# Altium project DL4-1BA.PrjPcb (part 2 of 2)

## Sheet PoE_Injector.SchDoc: IEEE 802.3AF/AT PSE Controller
size A3; CompanyName: FSCH; DrawnBy: ahorat / daniw; Engineer: ahorat / daniw; Address1: FS Switzerland; Address2: Zeltweg 57; Address3: 8032 Zürich; SheetNumber: 5; SheetTotal: 9
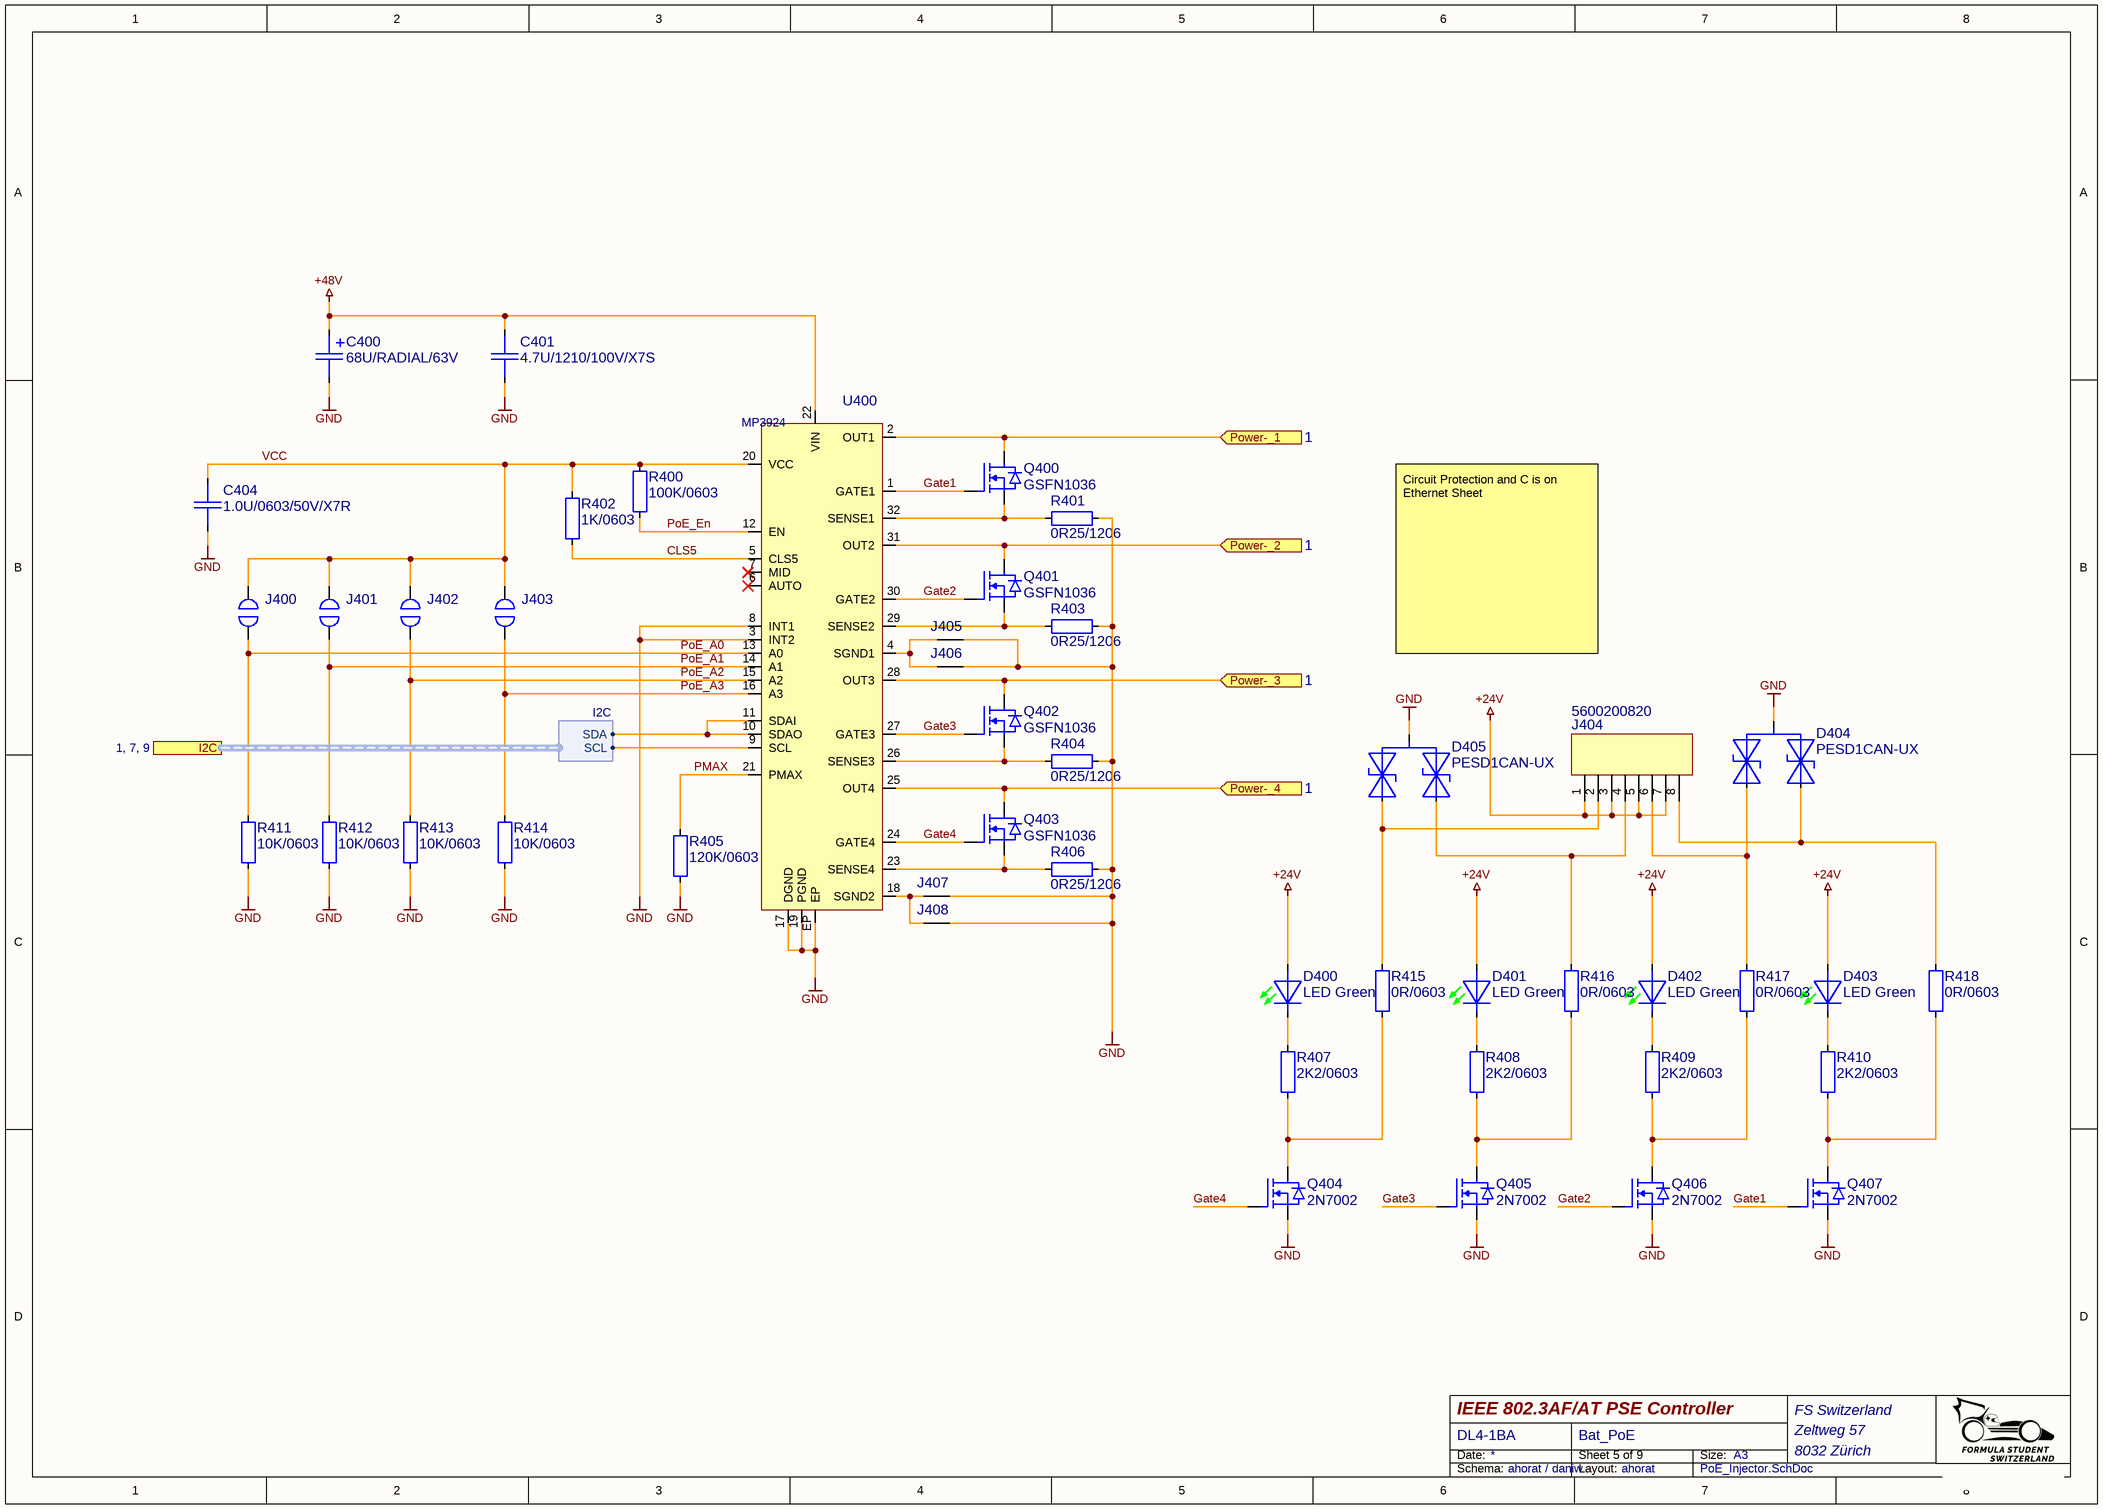
[diagram p3: PoE_Injector.SchDoc]

### Parts
C400  68U/RADIAL/63V  [CAP350P80X130]
C401  4.7U/1210/100V/X7S  [CAP1210_X7R]
C404  1.0U/0603/50V/X7R  [CAP0603_X7R]
D400  LED Green  [LED0603_GREEN]
D401  LED Green  [LED0603_GREEN]
D402  LED Green  [LED0603_GREEN]
D403  LED Green  [LED0603_GREEN]
D404  PESD1CAN-UX  [SOT65P210X95-3-SE]
D405  PESD1CAN-UX  [SOT65P210X95-3-SE]
J400  Solder Jumper 2pin 0.2mm small  [Solder_Jumper_2pin_0.2mm_small]  (value not drawn)
J401  Solder Jumper 2pin 0.2mm small  [Solder_Jumper_2pin_0.2mm_small]  (value not drawn)
J402  Solder Jumper 2pin 0.2mm small  [Solder_Jumper_2pin_0.2mm_small]  (value not drawn)
J403  Solder Jumper 2pin 0.2mm small  [Solder_Jumper_2pin_0.2mm_small]  (value not drawn)
J404  5600200820  [5600200820]
J405  NETTIE_025x050  [NETTIE_025x050]  (value not drawn)  (no BOM)
J406  NETTIE_025x050  [NETTIE_025x050]  (value not drawn)  (no BOM)
J407  NETTIE_025x050  [NETTIE_025x050]  (value not drawn)  (no BOM)
J408  NETTIE_025x050  [NETTIE_025x050]  (value not drawn)  (no BOM)
Q400  GSFN1036  [SON065P330X330X075-5-TH245X175]
Q401  GSFN1036  [SON065P330X330X075-5-TH245X175]
Q402  GSFN1036  [SON065P330X330X075-5-TH245X175]
Q403  GSFN1036  [SON065P330X330X075-5-TH245X175]
Q404  2N7002  [SOT2395P280X125-3-SE]
Q405  2N7002  [SOT2395P280X125-3-SE]
Q406  2N7002  [SOT2395P280X125-3-SE]
Q407  2N7002  [SOT2395P280X125-3-SE]
R400  100K/0603  [R0603-0.40-WW]
R401  0R25/1206  [R1206-0.80-WW]
R402  1K/0603  [R0603-0.40-WW]
R403  0R25/1206  [R1206-0.80-WW]
R404  0R25/1206  [R1206-0.80-WW]
R405  120K/0603  [R0603-0.40-WW]
R406  0R25/1206  [R1206-0.80-WW]
R407  2K2/0603  [R0603-0.40-WW]
R408  2K2/0603  [R0603-0.40-WW]
R409  2K2/0603  [R0603-0.40-WW]
R410  2K2/0603  [R0603-0.40-WW]
R411  10K/0603  [R0603-0.40-WW]
R412  10K/0603  [R0603-0.40-WW]
R413  10K/0603  [R0603-0.40-WW]
R414  10K/0603  [R0603-0.40-WW]
R415  0R/0603  [R0603-0.40-WW]
R416  0R/0603  [R0603-0.40-WW]
R417  0R/0603  [R0603-0.40-WW]
R418  0R/0603  [R0603-0.40-WW]
U400  MP3924  [QFN050P500X500X100-32-TH360X360]

### Ports
I2C (harness I2C, see 1, 7, 9), Power-_1 (in, see 1), Power-_2 (in, see 1), Power-_3 (in, see 1), Power-_4 (in, see 1)

### Harnesses
I2C: SCL, SDA

### Nets
+24V: D400.2 D401.2 D402.2 D403.2 J404.1 J404.3 J404.5 J404.7
+48V: C400.1 C401.1 U400.22(VIN)
GND: C400.2 C401.2 C404.2 D404.3 D405.3 J405.2 J406.2 J407.2 J408.2 Q404.2(SOURCE) Q405.2(SOURCE) Q406.2(SOURCE) Q407.2(SOURCE) R401.2 R403.2 R404.2 R405.2 R406.2 R411.2 R412.2 R413.2 R414.2 U400.3(INT2) U400.8(INT1) U400.17(DGND) U400.19(PGND) U400.EP
CLS5: R402.2 U400.5(CLS5)
Gate1: Q400.G(GATE) Q407.1(GATE) U400.1(GATE1)
Gate2: Q401.G(GATE) Q406.1(GATE) U400.30(GATE2)
Gate3: Q402.G(GATE) Q405.1(GATE) U400.27(GATE3)
Gate4: Q403.G(GATE) Q404.1(GATE) U400.24(GATE4)
PMAX: R405.1 U400.21(PMAX)
PoE_A0: J400.2 R411.1 U400.13(A0)
PoE_A1: J401.2 R412.1 U400.14(A1)
PoE_A2: J402.2 R413.1 U400.15(A2)
PoE_A3: J403.2 R414.1 U400.16(A3)
PoE_En: R400.2 U400.12(EN)
VCC: C404.1 J400.1 J401.1 J402.1 J403.1 R400.1 R402.1 U400.20(VCC)
NetD400_1: D400.1 R407.1
NetD401_1: D401.1 R408.1
NetD402_1: D402.1 R409.1
NetD403_1: D403.1 R410.1
NetD404_1: D404.1 J404.8 R418.1
NetD404_2: D404.2 J404.6 R417.1
NetD405_1: D405.1 J404.4 R416.1
NetD405_2: D405.2 J404.2 R415.1
NetJ405_1: J405.1 J406.1 U400.4(SGND1)
NetJ407_1: J407.1 J408.1 U400.18(SGND2)
NetQ400_D: Q400.D(DRAIN) U400.2(OUT1) ; port Power-_1
NetQ400_S: Q400.S(SOURCE) R401.1 U400.32(SENSE1)
NetQ401_D: Q401.D(DRAIN) U400.31(OUT2) ; port Power-_2
NetQ401_S: Q401.S(SOURCE) R403.1 U400.29(SENSE2)
NetQ402_D: Q402.D(DRAIN) U400.28(OUT3) ; port Power-_3
NetQ402_S: Q402.S(SOURCE) R404.1 U400.26(SENSE3)
NetQ403_D: Q403.D(DRAIN) U400.25(OUT4) ; port Power-_4
NetQ403_S: Q403.S(SOURCE) R406.1 U400.23(SENSE4)
NetQ404_3: Q404.3(DRAIN) R407.2 R415.2
NetQ405_3: Q405.3(DRAIN) R408.2 R416.2
NetQ406_3: Q406.3(DRAIN) R409.2 R417.2
NetQ407_3: Q407.3(DRAIN) R410.2 R418.2
NetU400_9: U400.9(SCL) ; port I2C.SCL
NetU400_10: U400.10(SDAO) U400.11(SDAI) ; port I2C.SDA

Not connected (* = marked no-connect by the designer): U400 6(AUTO)* 7(MID)*

### Notes on the sheet
- Circuit Protection and C is on Ethernet Sheet
- Date:
- Size:
- A3
- Schema:
- Layout:

### Library data of the parts
C400 = 68U/RADIAL/63V: CAP THT 8C130 68UF ELKO 63V; Manufacturer: GENERIC; Manufacturer 1: Würth Elektronik; Manufacturer Part Number 1: 860020774014; Absolute Value: 6.8E-5; Part Number: 68U/RADIAL/63V; Package: RADIAL; Value: 68UF; HelpURL: https://www.we-online.com/components/products/datasheet/860020774014.pdf; Supplier 1: Digi-Key; Supplier Part Number 1: 732-8975-1-ND; Manufacturer Part Number 3: LKMD0901K680MF; Supplier 3: LCSC; Supplier Part Number 3: C443065
C401 = 4.7U/1210/100V/X7S: CAP SM 1210 4.7uF 100V X7S; Manufacturer: GENERIC; Manufacturer 1: Murata; Manufacturer Part Number 1: GRM31CC72A475ME11L; Absolute Value: 4.7E-6; Eurocircuits GPN: GPN1210475-100; Part Number: 4.7U/1210/100V/X7S; Package: 1210; Value: 4.7uF; HelpURL: https://search.murata.co.jp/Ceramy/image/img/A01X/G101/ENG/GRM31CC72A475ME11-01A.pdf; Supplier 1: Digi-Key; Supplier Part Number 1: 490-18621-1-ND; Manufacturer Part Number 3: CGA1210X7S475K101RT; Supplier 3: LCSC; Supplier Part Number 3: C6120041
C404 = 1.0U/0603/50V/X7R: CAP SM 0603 1.0uF 50V X7R; Manufacturer: GENERIC; Manufacturer 1: YAGEO; Manufacturer Part Number 1: CC0603KRX7R9BB105; Absolute Value: 1E-6; Eurocircuits GPN: GPC0603105; Part Number: 1.0U/0603/50V/X7R; Package: 0603; Value: 1.0uF; HelpURL: https://www.yageo.com/upload/media/product/app/datasheet/mlcc/upy-gphc_x7r_6_3v-to-250v.pdf; Supplier 1: Digi-Key; Supplier Part Number 1: 311-2082-1-ND
D400-D403 = LED Green 0603: Generic LED Green 0603; Manufacturer 1: Würth; Manufacturer Part Number 1: 150060VS75000; Part Number: LED Green 0603; Manufacturer: GENERIC; Package: 603; Value: Green; Absolute Value: Green; HelpURL: https://www.we-online.com/katalog/datasheet/150060VS75000.pdf; Supplier 1: Digikey; Supplier Part Number 1: 732-4980-1-ND; Manufacturer 3: Everlight Elec; Manufacturer Part Number 3: 19-217/GHC-YR1S2/3T; Supplier 3: LCSC; Supplier Part Number 3: C72043; JLC Type: Basic
D404 D405 = PESD1CAN-UX: CAN bus ESD protection diode; Manufacturer: Nexperia USA Inc.; Absolute Value: 24V; Part Number: PESD1CAN-UX; Package: SOT323; Value: PESD1CAN-UX; HelpURL: https://assets.nexperia.com/documents/data-sheet/PESD1CAN-U.pdf; Manufacturer 1: Nexperia USA Inc.; Manufacturer Part Number 1: PESD1CAN-UX; Supplier 1: Digikey; Supplier Part Number 1: 1727-1306-1-ND; Manufacturer 3: Nexperia; Manufacturer Part Number 3: PESD1CAN-UX; Supplier 3: LCSC; Supplier Part Number 3: C152727
J400-J403 = Solder_Jumper_2pin_0.2mm_small: Solder jumper with two pins with a spacing of 0.2mm; Manufacturer: NONE; Part Number: Solder_Jumper_2pin_0.2mm_small
J404 = DuraClick_1x8_VERT_SMD: DuraClik Wire-to-Board Header, Single Row, Vertical, 8 Circuits, Tin (Sn) Over Nickel, Natural; Manufacturer 1: Molex; Part Number: DuraClick_1x8_VERT_SMD; HelpURL: https://www.molex.com/en-us/products/part-detail/5600200820; Manufacturer Part Number 1: 5600200820; Supplier 1: Digi-Key; Supplier Part Number 1: WM10868CT-ND; Manufacturer: Molex
J405-J408 = NETTIE_025x050: Manufacturer: NONE; Part Number: NETTIE_025x050
Q400-Q403 = GSFN1036: N-Kanal 100 V 35 A (Tc) 52W (Tc) Oberflächenmontage 8-PPAK (3,1x3,05); Manufacturer: Good-Ark Semiconductor; Part Number: GSFN1036; Package: 8-PowerVDFN; Manufacturer 1: Good-Ark Semiconductor; Manufacturer Part Number 1: GSFN1036; Supplier 1: Digi-Key; Supplier Part Number 1: 4786-GSFN1036CT-ND; HelpURL: https://goodarksemi.com/docs/datasheets/mosfets/GSFN1036.pdf
Q404-Q407 = 2N7002: 60V 115mA 1.2Ω@10V,500mA 200mW 2.1V@250uA N Channel SOT-23 MOSFETs; Manufacturer: GENERIC; Manufacturer 1: Nexperia USA Inc.; Manufacturer Part Number 1: 2N7002NXAKR; Part Number: 2N7002; Package: SOT23; HelpURL: https://assets.nexperia.com/documents/data-sheet/2N7002NXAK.pdf; Supplier 1: Digi-Key; Supplier Part Number 1: 1727-8643-1-ND; Manufacturer 3: JSMSEMI; Manufacturer Part Number 3: JSMSEMI; Supplier 3: LCSC; Supplier Part Number 3: C916396; JLC Type: Extended
R400 = 100K/0603: RES SM 0603 100K; Manufacturer: GENERIC; Manufacturer 1: YAGEO; Manufacturer Part Number 1: RC0603FR-13100KL; Absolute Value: 100000; Eurocircuits GPN: GPR0603100K; Part Number: 100K/0603; Package: 0603; Value: 100K; HelpURL: https://www.yageo.com/upload/media/product/productsearch/datasheet/rchip/PYu-RC_Group_51_RoHS_L_12.pdf; Supplier 1: Digi-Key; Supplier Part Number 1: 13-RC0603FR-13100KLCT-ND; Manufacturer 2: YAGEO; Manufacturer Part Number 2: RC0603FR-10100KL; Supplier 2: Digi-Key; Supplier Part Number 2: 13-RC0603FR-10100KLCT-ND; Manufacturer 3: UNI-ROYAL(Uniroyal Elec); Manufacturer Part Number 3: 0603WAF1003T5E; Supplier 3: LCSC; Supplier Part Number 3: C25803; JLC Type: Basic
R401 R403 R404 R406 = 0R25/1206: RES SM 1206 0R25; Manufacturer: GENERIC; Manufacturer 1: YAGEO; Manufacturer Part Number 1: RL1206FR-070R25L; Absolute Value: 0.25; Eurocircuits GPN: GPR12060R25; Part Number: 0R25/1206; Package: 1206; Value: 0R25; HelpURL: https://www.yageo.com/upload/media/product/app/datasheet/rchip/pyu-rl_group_521_rohs_l.pdf; Supplier 1: Digi-Key; Supplier Part Number 1: 311-.25LWCT-ND; Manufacturer 3: RALEC; Manufacturer Part Number 3: RLT06R25JTP; Supplier 3: LCSC; Supplier Part Number 3: C7500327
R402 = 1K/0603: RES SM 0603 1K; Manufacturer: GENERIC; Manufacturer 1: YAGEO; Manufacturer Part Number 1: RC0603FR-131KL; Absolute Value: 1000; Eurocircuits GPN: GPR06031K; Part Number: 1K/0603; Package: 0603; Value: 1K; HelpURL: https://www.yageo.com/upload/media/product/app/datasheet/rchip/pyu-rc_group_51_rohs_l.pdf; Supplier 1: Digi-Key; Supplier Part Number 1: 13-RC0603FR-131KLCT-ND; Manufacturer 2: YAGEO; Manufacturer Part Number 2: RC0603FR-101KL; Supplier 2: Digi-Key; Supplier Part Number 2: 13-RC0603FR-101KLCT-ND; Manufacturer 3: UNI-ROYAL(Uniroyal Elec); Manufacturer Part Number 3: 0603WAF1001T5E; Supplier 3: LCSC; Supplier Part Number 3: C21190; JLC Type: Basic
R405 = 120K/0603: RES SM 0603 120K; Manufacturer: GENERIC; Manufacturer 1: YAGEO; Manufacturer Part Number 1: RC0603FR-13120KL; Absolute Value: 120000; Eurocircuits GPN: GPR0603120K; Part Number: 120K/0603; Package: 0603; Value: 120K; HelpURL: https://www.yageo.com/upload/media/product/app/datasheet/rchip/pyu-rc_group_51_rohs_l.pdf; Supplier 1: Digi-Key; Supplier Part Number 1: 13-RC0603FR-13120KLCT-ND; Manufacturer 2: YAGEO; Manufacturer Part Number 2: RC0603FR-10120KL; Supplier 2: Digi-Key; Supplier Part Number 2: 13-RC0603FR-10120KLCT-ND
R407-R410 = 2K2/0603: RES SM 0603 2K2; Manufacturer: GENERIC; Manufacturer 1: YAGEO; Manufacturer Part Number 1: RC0603FR-132K2L; Absolute Value: 2200; Eurocircuits GPN: GPR06032K2; Part Number: 2K2/0603; Package: 0603; Value: 2K2; HelpURL: https://www.yageo.com/upload/media/product/app/datasheet/rchip/pyu-rc_group_51_rohs_l.pdf; Supplier 1: Digi-Key; Supplier Part Number 1: 13-RC0603FR-132K2LCT-ND; Manufacturer 2: YAGEO; Manufacturer Part Number 2: RC0603FR-102K2L; Supplier 2: Digi-Key; Supplier Part Number 2: 13-RC0603FR-102K2LCT-ND; Manufacturer 3: YAGEO; Manufacturer Part Number 3: RC0603JR-072K2L; Supplier 3: LCSC; Supplier Part Number 3: C113303
R411-R414 = 10K/0603: RES SM 0603 10K; Manufacturer: GENERIC; Manufacturer 1: YAGEO; Manufacturer Part Number 1: RC0603FR-1310KL; Absolute Value: 10000; Eurocircuits GPN: GPR060310K; Part Number: 10K/0603; Package: 0603; Value: 10K; HelpURL: https://www.yageo.com/upload/media/product/productsearch/datasheet/rchip/PYu-RC_Group_51_RoHS_L_12.pdf; Supplier 1: Digi-Key; Supplier Part Number 1: 13-RC0603FR-1310KLCT-ND; Manufacturer 2: YAGEO; Manufacturer Part Number 2: RC0603FR-1010KL; Supplier 2: Digi-Key; Supplier Part Number 2: 13-RC0603FR-1010KLCT-ND; Manufacturer 3: UNI-ROYAL(Uniroyal Elec); Manufacturer Part Number 3: 0603WAF1002T5E; Supplier 3: LCSC; Supplier Part Number 3: C25804; JLC Type: Basic
R415-R418 = 0R/0603: RES SM 0603 0R; Manufacturer: GENERIC; Manufacturer 1: YAGEO; Manufacturer Part Number 1: RC0603FR-070RL; Absolute Value: 0; Eurocircuits GPN: GPR06030R; Part Number: 0R/0603; Package: 0603; Value: 0R; HelpURL: https://www.yageo.com/upload/media/product/app/datasheet/rchip/pyu-rc_group_51_rohs_l.pdf; Supplier 1: Digi-Key; Supplier Part Number 1: 311-0.0HRCT-ND; Manufacturer 2: YAGEO; Manufacturer Part Number 2: RC0603FR-130RL; Supplier 2: Digi-Key; Supplier Part Number 2: 13-RC0603FR-130RLCT-ND; Manufacturer 3: UNI-ROYAL(Uniroyal Elec); Manufacturer Part Number 3: 0603WAF0000T5E; Supplier 3: LCSC; Supplier Part Number 3: C21189; JLC Type: Basic
U400 = MP3924: Quad-Port, IEEE 802.3af/at PSE Controller for Power over Ethernet; Manufacturer: MPS; Manufacturer 1: Monolithic Power Systems Inc.; Manufacturer Part Number 1: MP3924GU-Z; Part Number: MP3924; Package: QFN-32; HelpURL: https://www.monolithicpower.com/en/documentview/productdocument/index/version/2/document_type/Datasheet/lang/en/sku/MP3924GU/document_id/9919/; Supplier 1: Digi-Key; Supplier Part Number 1: 1589-MP3924GU-ZCT-ND

## Sheet ON_OFF_Controller.SchDoc: On/Off Controller
size A3; CompanyName: FSCH; DrawnBy: ahorat / daniw; Engineer: ahorat / daniw; Address1: FS Switzerland; Address2: Zeltweg 57; Address3: 8032 Zürich; SheetNumber: 9; SheetTotal: 9
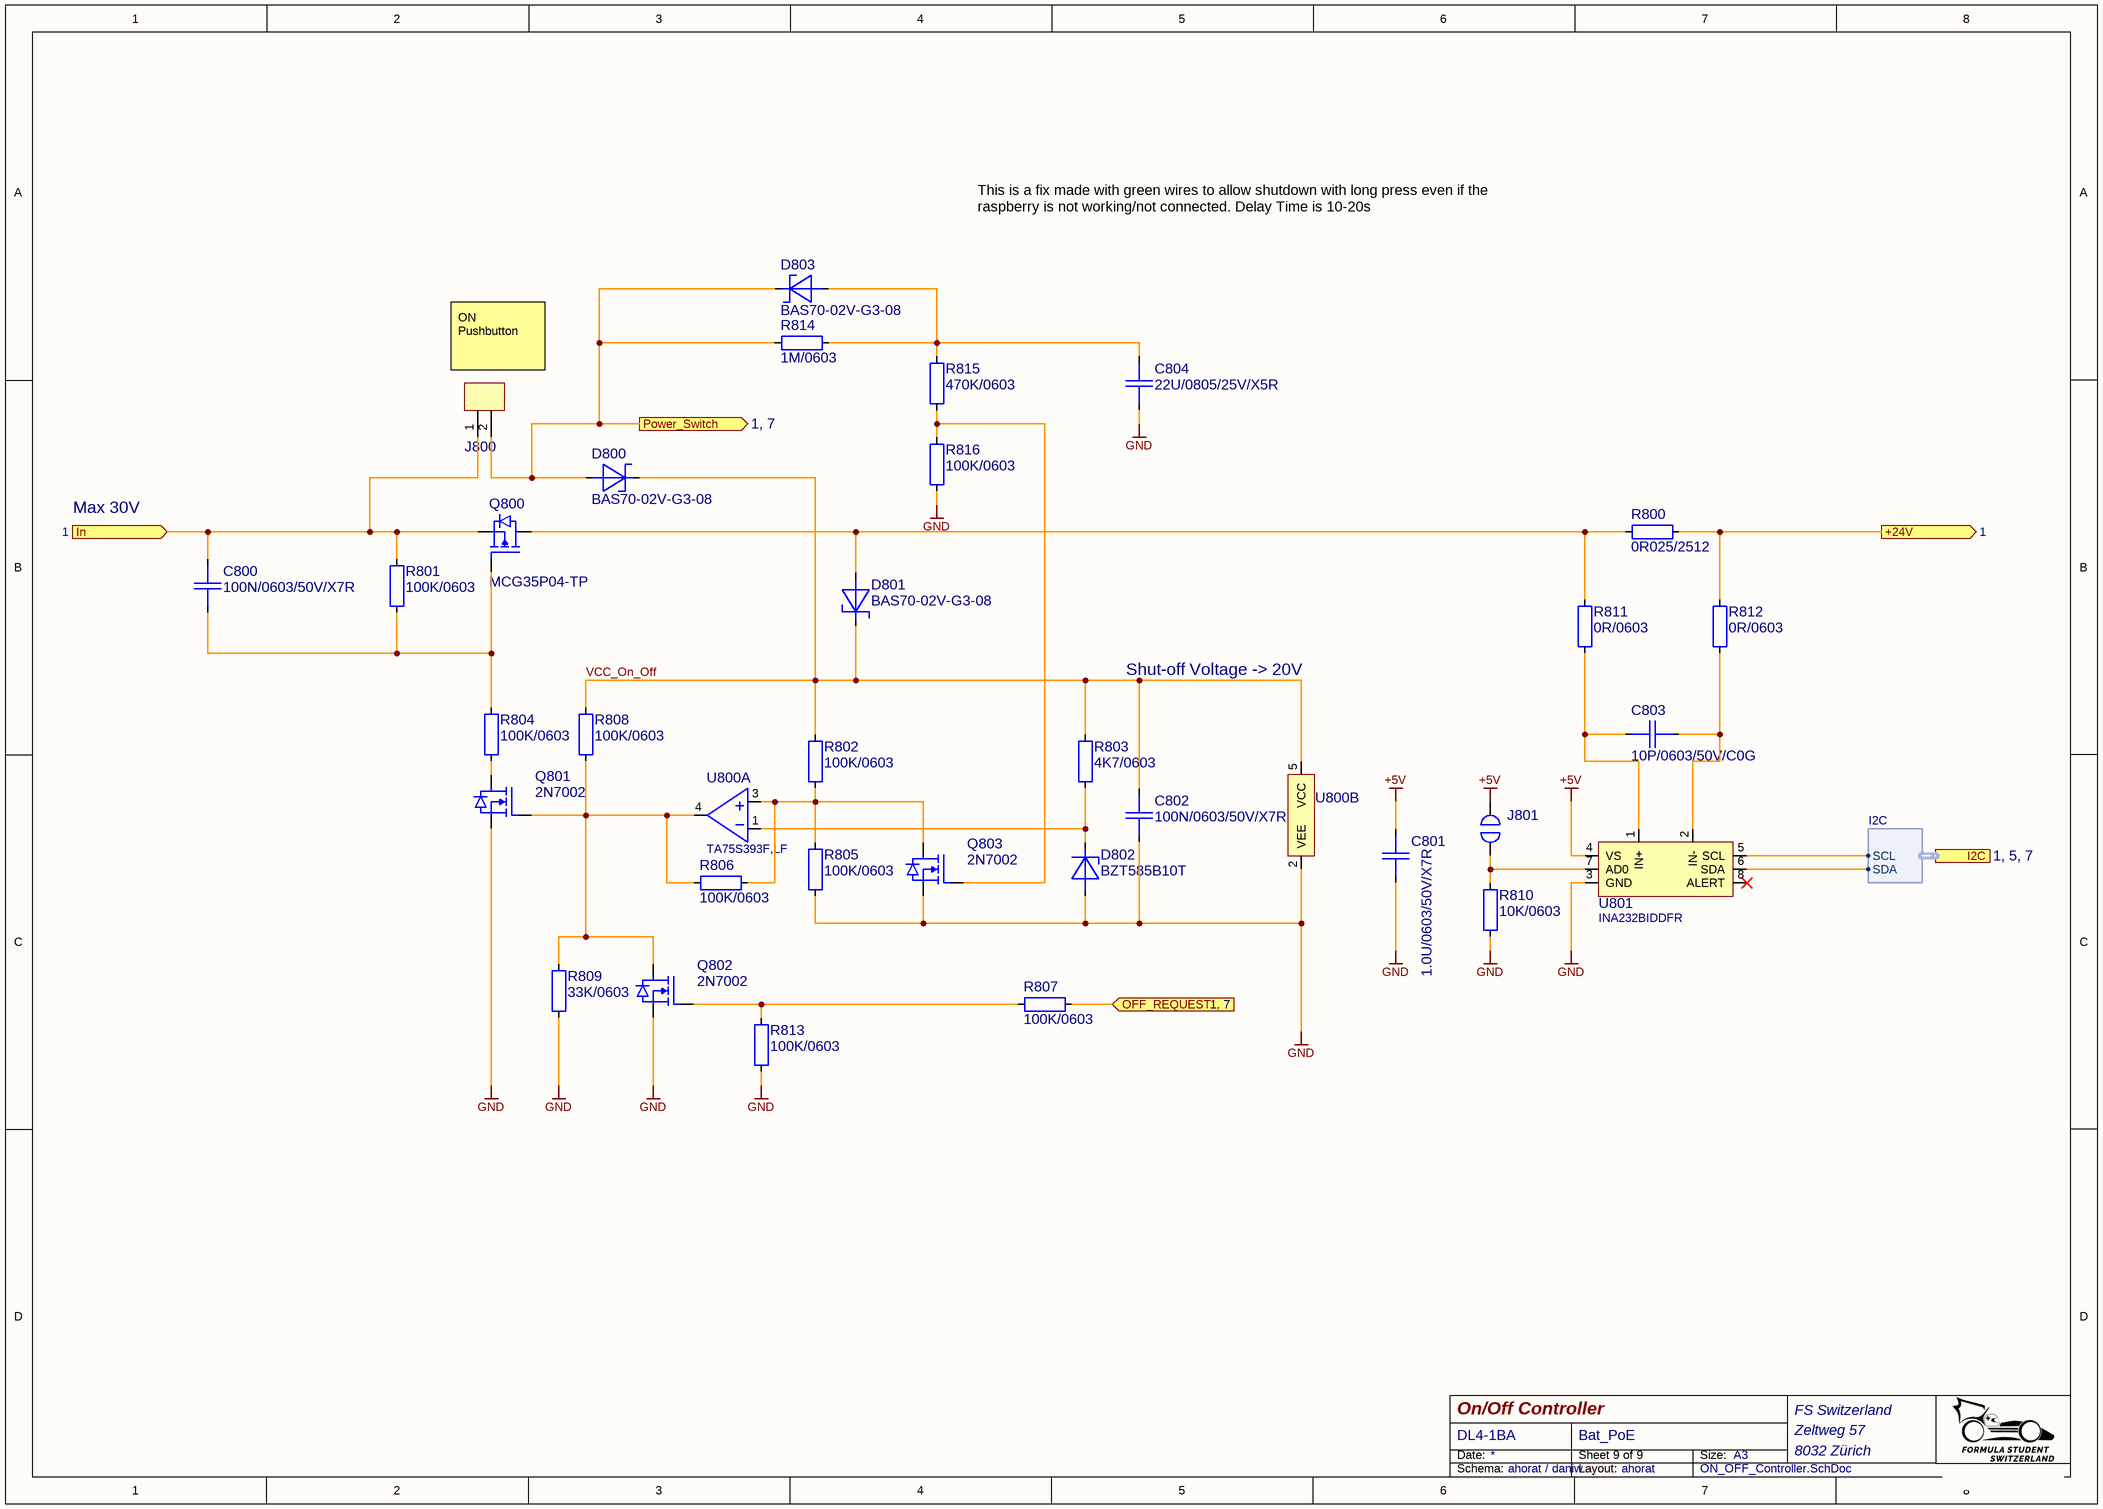
[diagram p4: ON_OFF_Controller.SchDoc]

### Parts
C800  100N/0603/50V/X7R  [CAP0603_X7R]
C801  1.0U/0603/50V/X7R  [CAP0603_X7R]
C802  100N/0603/50V/X7R  [CAP0603_X7R]
C803  10P/0603/50V/C0G  [CAP0603_C0G]
C804  22U/0805/25V/X5R  [CAP0805_X7R]
D800  BAS70-02V-G3-08  [SOD1608X065]
D801  BAS70-02V-G3-08  [SOD1608X065]
D802  BZT585B10T  [SOD1608X065]
D803  BAS70-02V-G3-08  [SOD1608X065]
J800  5600200220  [5600200220]  (value not drawn)
J801  Solder Jumper 2pin 0.2mm small  [Solder_Jumper_2pin_0.2mm_small]  (value not drawn)
Q800  MCG35P04-TP  [SON065P330X330X075-5-TH245X175]
Q801  2N7002  [SOT2395P280X125-3-SE]
Q802  2N7002  [SOT2395P280X125-3-SE]
Q803  2N7002  [SOT2395P280X125-3-SE]
R800  0R025/2512  [R2512-0.65-WW]
R801  100K/0603  [R0603-0.40-WW]
R802  100K/0603  [R0603-0.40-WW]
R803  4K7/0603  [R0603-0.40-WW]
R804  100K/0603  [R0603-0.40-WW]
R805  100K/0603  [R0603-0.40-WW]
R806  100K/0603  [R0603-0.40-WW]
R807  100K/0603  [R0603-0.40-WW]
R808  100K/0603  [R0603-0.40-WW]
R809  33K/0603  [R0603-0.40-WW]
R810  10K/0603  [R0603-0.40-WW]
R811  0R/0603  [R0603-0.40-WW]
R812  0R/0603  [R0603-0.40-WW]
R813  100K/0603  [R0603-0.40-WW]
R814  1M/0603  [R0603-0.40-WW]
R815  470K/0603  [R0603-0.40-WW]
R816  100K/0603  [R0603-0.40-WW]
U800  TA75S393F,LF  [SOT2395P280X125-5-SW]  (parts A,B of 2)
U801  INA232BIDDFR  [SOT065P280X110-8-SE]

### Ports
+24V (out, see 1), I2C (harness I2C, see 1, 5, 7), In (in, see 1), OFF_REQUEST (in, see 1, 7), Power_Switch (out, see 1, 7)

### Harnesses
I2C: SDA, SCL

### Nets
+5V: C801.1 J801.1 U801.4(VS)
GND: C801.2 C802.2 C804.2 D802.2 Q801.2(SOURCE) Q802.2(SOURCE) Q803.2(SOURCE) R805.2 R809.2 R810.2 R813.2 R816.2 U800.2(VEE) U801.3(GND)
VCC_On_Off: C802.1 D800.1 D801.1 R802.1 R803.1 R808.1 U800.5(VCC)
NetC800_1: C800.1 J800.1 Q800.S(SOURCE) R801.1 ; port In
NetC800_2: C800.2 Q800.G(GATE) R801.2 R804.1
NetC803_1: C803.1 R812.2 U801.2(IN-)
NetC803_2: C803.2 R811.2 U801.1(IN+)
NetC804_1: C804.1 D803.2 R814.2 R815.2
NetD800_2: D800.2 D803.1 J800.2 R814.1 ; port Power_Switch
NetD801_2: D801.2 Q800.D(DRAIN) R800.1 R811.1
NetD802_1: D802.1 R803.2 U800.1(IN-)
NetJ801_2: J801.2 R810.1 U801.7(AD0)
NetQ801_1: Q801.1(GATE) Q802.3(DRAIN) R806.2 R808.2 R809.1 U800.4(OUT)
NetQ801_3: Q801.3(DRAIN) R804.2
NetQ802_1: Q802.1(GATE) R807.2 R813.1
NetQ803_1: Q803.1(GATE) R815.1 R816.1
NetQ803_3: Q803.3(DRAIN) R802.2 R805.1 R806.1 U800.3(IN+)
NetR800_2: R800.2 R812.1 ; port +24V
NetR807_1: R807.1 ; port OFF_REQUEST
NetU400_9: U801.5(SCL) ; port I2C.SCL
NetU400_10: U801.6(SDA) ; port I2C.SDA

Not connected (* = marked no-connect by the designer): U801 8(ALERT)*

### Notes on the sheet
- This is a fix made with green wires to allow shutdown with long press even if the raspberry is not working/not connected. Delay Time is 10-20s
- (near J800) ON Pushbutton
- Max 30V
- Shut-off Voltage -> 20V
- Date:
- Size:
- A3
- Schema:
- Layout:

### Library data of the parts
C800 C802 = 100N/0603/50V/X7R: CAP SM 0603 100nF 50V X7R; Manufacturer: GENERIC; Manufacturer 1: YAGEO; Manufacturer Part Number 1: CC0603KPX7R9BB104; Absolute Value: 1E-7; Eurocircuits GPN: GPC0603104; Part Number: 100N/0603/50V/X7R; Package: 0603; Value: 100nF; HelpURL: https://www.yageo.com/upload/media/product/app/datasheet/mlcc/upy-gphc_x7r_6_3v-to-250v.pdf; Supplier 1: Digi-Key; Supplier Part Number 1: 311-3567-1-ND; Manufacturer 2: YAGEO; Manufacturer Part Number 2: CC0603MRX7R9BB104; Supplier 2: Digi-Key; Supplier Part Number 2: 311-4110-1-ND; Supplier 3: LCSC; Supplier Part Number 3: C14663; JLC Type: Basic
C801 = 1.0U/0603/50V/X7R: as C404 on sheet PoE_Injector; Part Number: 1.0U/0603/50V/X7R; Package: 0603; Value: 1.0uF; HelpURL: https://www.yageo.com/upload/media/product/app/datasheet/mlcc/upy-gphc_x7r_6_3v-to-250v.pdf; Supplier 1: Digi-Key; Supplier Part Number 1: 311-2082-1-ND
C803 = 10P/0603/50V/C0G: CAP SM 0603 10pF 50V C0G; Manufacturer: GENERIC; Manufacturer 1: YAGEO; Manufacturer Part Number 1: CC0603JRNPO9BN100; Absolute Value: 1E-11; Eurocircuits GPN: GPC0603100-C0G; Part Number: 10P/0603/50V/C0G; Package: 0603; Value: 10pF; HelpURL: https://www.yageo.com/upload/media/product/productsearch/datasheet/mlcc/UPY-GP_NP0_16V-to-50V_18.pdf; Supplier 1: Digi-Key; Supplier Part Number 1: 311-1058-1-ND; Manufacturer 2: YAGEO; Manufacturer Part Number 2: CC0603KRNPO9BN100; Supplier 2: Digi-Key; Supplier Part Number 2: 311-4025-1-ND
C804 = 22U/0805/25V/X5R: CAP SM 0805 22uF 25V X5R; Manufacturer: GENERIC; Manufacturer 1: Samsung Electro-Mechanics; Manufacturer Part Number 1: CL21A226MAYNNNE; Absolute Value: 2.2E-5; Eurocircuits GPN: GPN0805106-25; Part Number: 22U/0805/25V/X5R; Package: 0805; Value: 22uF; HelpURL: https://mm.digikey.com/Volume0/opasdata/d220001/medias/docus/339/CL21A226MAYNNNE_Spec.pdf; Supplier 1: Digi-Key; Supplier Part Number 1: 1276-CL21A226MAYNNNECT-ND; Manufacturer Part Number 3: CL21A226MAQNNNE; Supplier 3: LCSC; Supplier Part Number 3: C45783; JLC Type: Basic
D800 D801 D803 = BAS70-02V-G3-08: Small Signal Schottky Diode; Manufacturer: Vishay; Manufacturer 1: Vishay General Semiconductor - Diodes Division; Value: 70V/100mA; Absolute Value: 70V; Part Number: BAS70-02V-G3-08; Package: SOD523; HelpURL: https://www.vishay.com/docs/85652/bas70-02v.pdf; Manufacturer 3: Vishay Intertech; Manufacturer Part Number 3: BAS70-02V-G3-08; Supplier 3: LCSC; Supplier Part Number 3: C3313114; JLC Type: Extended; Manufacturer Part Number 1: BAS70-02V-G3-08; Supplier 1: Digikey; Supplier Part Number 1: 112-BAS70-02V-G3-08CT-ND
D802 = BZT585B10T: DIODE ZENER 10V 350MW SOD523; Manufacturer: Diodes Incorporated; Manufacturer Part Number 1: BZT585B10T-7; Part Number: BZT585B10T; Package: SC-79, SOD-523; Value: BZT585B10T; Absolute Value: 10 V; HelpURL: https://www.diodes.com/assets/Datasheets/BZT585BxVxT.pdf; Manufacturer 1: Diodes Incorporated; Supplier 1: Digikey; Supplier Part Number 1: BZT585B10T-7DICT-ND
J800 = DuraClick_1x2_VERT_SMD: DuraClik Wire-to-Board Header, Single Row, Vertical, 2 Circuits, Tin (Sn) Over Nickel, Natural; Manufacturer 1: Molex; Part Number: DuraClick_1x2_VERT_SMD; HelpURL: https://www.molex.com/en-us/products/part-detail/5600200220; Manufacturer Part Number 1: 5600200220; Supplier 1: Digi-Key; Supplier Part Number 1: WM10862CT-ND; Manufacturer: Molex
J801 = Solder_Jumper_2pin_0.2mm_small: as J400 on sheet PoE_Injector; Part Number: Solder_Jumper_2pin_0.2mm_small
Q800 = MCG35P04-TP: 40V 35A P-Channel MOSFET; Manufacturer: Micro Commercial Co; Manufacturer Part Number 1: 353-MCG35P04-TPCT-ND; Part Number: MCG35P04-TP; HelpURL: https://www.mccsemi.com/pdf/Products/MCG35P04(DFN3333).pdf; Manufacturer 1: Micro Commercial Co; Supplier 1: Digi-Key; Supplier Part Number 1: 353-MCG35P04-TPCT-ND; Package: 8-PowerVDFN
Q801-Q803 = 2N7002: as Q404 on sheet PoE_Injector; Part Number: 2N7002; Package: SOT23; HelpURL: https://assets.nexperia.com/documents/data-sheet/2N7002NXAK.pdf; Supplier 1: Digi-Key; Supplier Part Number 1: 1727-8643-1-ND; Manufacturer 3: JSMSEMI; Manufacturer Part Number 3: JSMSEMI; Supplier 3: LCSC; Supplier Part Number 3: C916396; JLC Type: Extended
R800 = 0R025/2512: RES SM 2512 0R025; Manufacturer: GENERIC; Manufacturer 1: Ohmite; Manufacturer Part Number 1: MCS3264R025FER; Absolute Value: 0.025; Part Number: 0R025/2512; Package: 2512; Value: 0R025; HelpURL: https://www.ohmite.com/assets/docs/res_mcs.pdf?r=false; Supplier 1: Digi-Key; Supplier Part Number 1: MCS3264R025FERCT-ND
R801 R802 R804-R808 R813 R816 = 100K/0603: as R400 on sheet PoE_Injector; Part Number: 100K/0603; Package: 0603; Value: 100K; HelpURL: https://www.yageo.com/upload/media/product/productsearch/datasheet/rchip/PYu-RC_Group_51_RoHS_L_12.pdf; Supplier 1: Digi-Key; Supplier Part Number 1: 13-RC0603FR-13100KLCT-ND; Manufacturer 2: YAGEO; Manufacturer Part Number 2: RC0603FR-10100KL; Supplier 2: Digi-Key; Supplier Part Number 2: 13-RC0603FR-10100KLCT-ND; Manufacturer 3: UNI-ROYAL(Uniroyal Elec); Manufacturer Part Number 3: 0603WAF1003T5E; Supplier 3: LCSC; Supplier Part Number 3: C25803; JLC Type: Basic
R803 = 4K7/0603: RES SM 0603 4K7; Manufacturer: GENERIC; Manufacturer 1: YAGEO; Manufacturer Part Number 1: RC0603FR-134K7L; Absolute Value: 4700; Eurocircuits GPN: GPR06034K7; Part Number: 4K7/0603; Package: 0603; Value: 4K7; HelpURL: https://www.yageo.com/upload/media/product/app/datasheet/rchip/pyu-rc_group_51_rohs_l.pdf; Supplier 1: Digi-Key; Supplier Part Number 1: 13-RC0603FR-134K7LCT-ND; Manufacturer 2: YAGEO; Manufacturer Part Number 2: RC0603FR-104K7L; Supplier 2: Digi-Key; Supplier Part Number 2: 13-RC0603FR-104K7LCT-ND; Manufacturer 3: UNI-ROYAL(Uniroyal Elec); Manufacturer Part Number 3: 0603WAF4701T5E; Supplier 3: LCSC; Supplier Part Number 3: C23162; JLC Type: Basic
R809 = 33K/0603: RES SM 0603 33K; Manufacturer: GENERIC; Manufacturer 1: YAGEO; Manufacturer Part Number 1: RC0603FR-1333KL; Absolute Value: 33000; Eurocircuits GPN: GPR060333K; Part Number: 33K/0603; Package: 0603; Value: 33K; HelpURL: https://www.yageo.com/upload/media/product/app/datasheet/rchip/pyu-rc_group_51_rohs_l.pdf; Supplier 1: Digi-Key; Supplier Part Number 1: 13-RC0603FR-1333KLCT-ND; Manufacturer 2: YAGEO; Manufacturer Part Number 2: RC0603FR-1033KL; Supplier 2: Digi-Key; Supplier Part Number 2: 13-RC0603FR-1033KLCT-ND
R810 = 10K/0603: as R411 on sheet PoE_Injector; Part Number: 10K/0603; Package: 0603; Value: 10K; HelpURL: https://www.yageo.com/upload/media/product/productsearch/datasheet/rchip/PYu-RC_Group_51_RoHS_L_12.pdf; Supplier 1: Digi-Key; Supplier Part Number 1: 13-RC0603FR-1310KLCT-ND; Manufacturer 2: YAGEO; Manufacturer Part Number 2: RC0603FR-1010KL; Supplier 2: Digi-Key; Supplier Part Number 2: 13-RC0603FR-1010KLCT-ND; Manufacturer 3: UNI-ROYAL(Uniroyal Elec); Manufacturer Part Number 3: 0603WAF1002T5E; Supplier 3: LCSC; Supplier Part Number 3: C25804; JLC Type: Basic
R811 R812 = 0R/0603: as R415 on sheet PoE_Injector; Part Number: 0R/0603; Package: 0603; Value: 0R; HelpURL: https://www.yageo.com/upload/media/product/app/datasheet/rchip/pyu-rc_group_51_rohs_l.pdf; Supplier 1: Digi-Key; Supplier Part Number 1: 311-0.0HRCT-ND; Manufacturer 2: YAGEO; Manufacturer Part Number 2: RC0603FR-130RL; Supplier 2: Digi-Key; Supplier Part Number 2: 13-RC0603FR-130RLCT-ND; Manufacturer 3: UNI-ROYAL(Uniroyal Elec); Manufacturer Part Number 3: 0603WAF0000T5E; Supplier 3: LCSC; Supplier Part Number 3: C21189; JLC Type: Basic
R814 = 1M/0603: RES SM 0603 1M; Manufacturer: GENERIC; Manufacturer 1: YAGEO; Manufacturer Part Number 1: RC0603FR-131ML; Absolute Value: 1000000; Eurocircuits GPN: GPR06031M; Part Number: 1M/0603; Package: 0603; Value: 1M; HelpURL: https://www.yageo.com/upload/media/product/app/datasheet/rchip/pyu-rc_group_51_rohs_l.pdf; Supplier 1: Digi-Key; Supplier Part Number 1: 13-RC0603FR-131MLCT-ND; Manufacturer 2: YAGEO; Manufacturer Part Number 2: RC0603FR-101ML; Supplier 2: Digi-Key; Supplier Part Number 2: 13-RC0603FR-101MLCT-ND; Manufacturer 3: UNI-ROYAL(Uniroyal Elec); Manufacturer Part Number 3: 0603WAF1004T5E; Supplier 3: C22935; Supplier Part Number 3: LCSC; JLC Type: Basic
R815 = 470K/0603: RES SM 0603 470K; Manufacturer: GENERIC; Manufacturer 1: YAGEO; Manufacturer Part Number 1: RC0603FR-13470KL; Absolute Value: 470000; Eurocircuits GPN: GPR0603470K; Part Number: 470K/0603; Package: 0603; Value: 470K; HelpURL: https://www.yageo.com/upload/media/product/app/datasheet/rchip/pyu-rc_group_51_rohs_l.pdf; Supplier 1: Digi-Key; Supplier Part Number 1: 13-RC0603FR-13470KLCT-ND; Manufacturer 2: YAGEO; Manufacturer Part Number 2: RC0603FR-10470KL; Supplier 2: Digi-Key; Supplier Part Number 2: 13-RC0603FR-10470KLCT-ND
U800 = TA75S393F,LF: 36V Single Voltage Comparator; Manufacturer: Toshiba Semiconductor and Storage; Part Number: TA75S393F,LF; Package: SOT23-5; HelpURL: https://toshiba.semicon-storage.com/info/TA75S393F_datasheet_en_20220525.pdf?did=20981&prodName=TA75S393F; Manufacturer 1: Toshiba Semiconductor and Storage; Manufacturer Part Number 1: TA75S393F,LF; Supplier 1: Digi-Key; Supplier Part Number 1: TA75S393FLFCT-ND; Manufacturer 3: TOSHIBA; Manufacturer Part Number 3: TA75S393F,LF(T; Supplier 3: LCSC; Supplier Part Number 3: C840438
U801 = INA232BIDDFR: INA232 48-V, 16-Bit, Current, Voltage, and Power Monitor With an I2C Interface; Manufacturer: Texas Instruments; Part Number: INA232BIDDFR; Package: SOT23-8; HelpURL: https://www.ti.com/lit/ds/symlink/ina232.pdf; Manufacturer 1: Texas Instruments; Manufacturer Part Number 1: INA232BIDDFR; Supplier 1: Digi-Key; Supplier Part Number 1: 296-INA232BIDDFRCT-ND

## Nets that join several sheets
+24V: DC_DC_Converter (C300.1 L300.1), PoE_Injector (8 pins)
+48V: DC_DC_Converter (C307.1 C308.1 C309.1 L302.2), PoE_Injector (C400.1 C401.1 U400.22)
GND: DC_DC_Converter (23 pins), PoE_Injector (27 pins), ON_OFF_Controller (14 pins)
NetU400_9: PoE_Injector (U400.9), ON_OFF_Controller (U801.5)
NetU400_10: PoE_Injector (U400.10 U400.11), ON_OFF_Controller (U801.6)

## Assembly variants
DownloadStation: not fitted C221_Charger Lower C221_Charger Upper R806